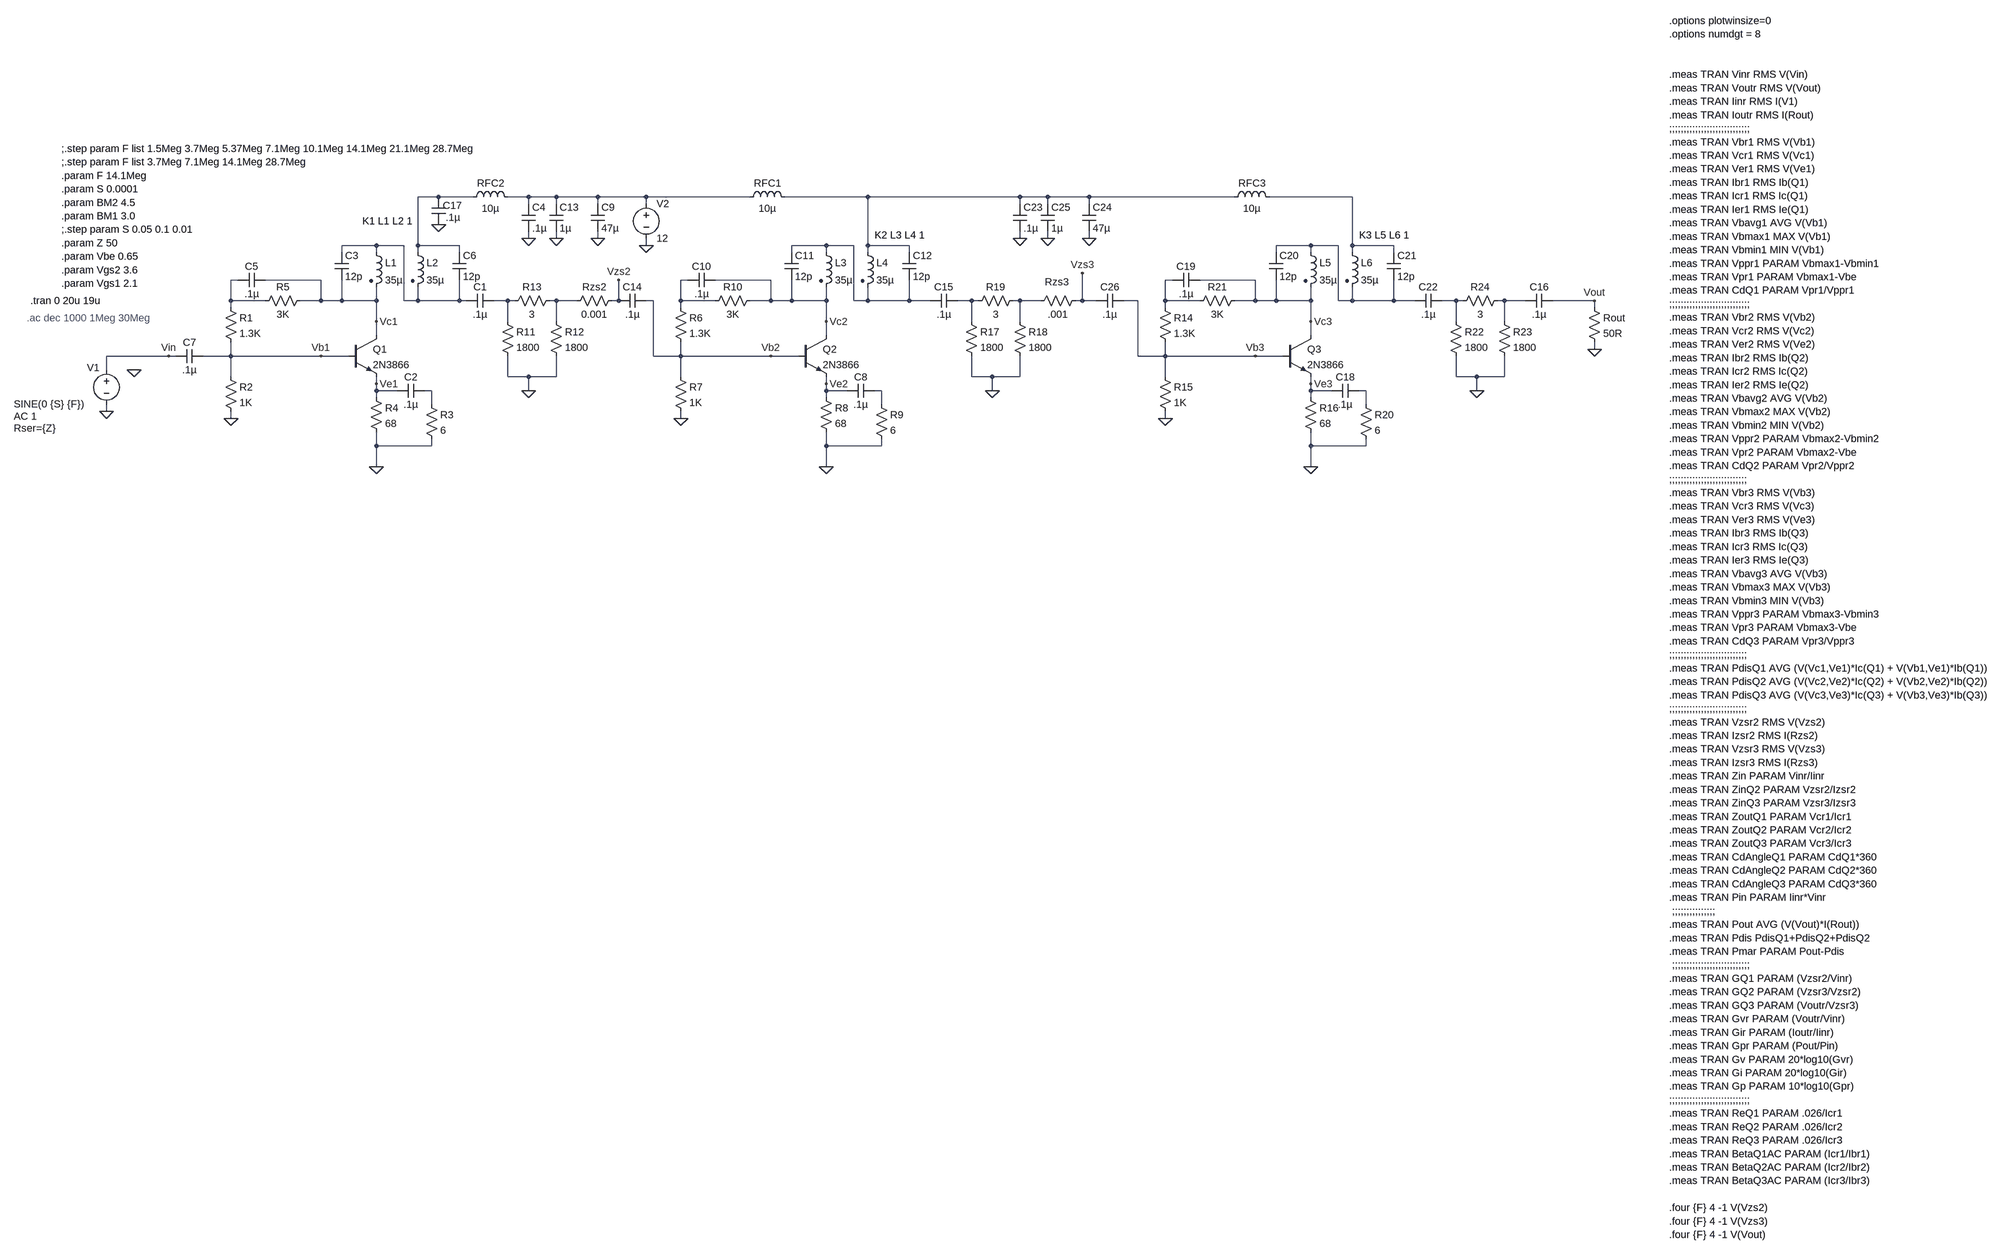
[diagram p0: schematic 2N3866 x3 EMRFD testing.asc]
2N3866 x3 EMRFD testing.asc, the LTspice schematic file:
Version 4
SHEET 1 5068 2428
WIRE 560 -176 512 -176
WIRE 640 -176 560 -176
WIRE 768 -176 720 -176
WIRE 832 -176 768 -176
WIRE 928 -176 832 -176
WIRE 1040 -176 928 -176
WIRE 1280 -176 1040 -176
WIRE 1552 -176 1360 -176
WIRE 1904 -176 1552 -176
WIRE 1968 -176 1904 -176
WIRE 2064 -176 1968 -176
WIRE 2400 -176 2064 -176
WIRE 2672 -176 2480 -176
WIRE 768 -160 768 -176
WIRE 832 -160 832 -176
WIRE 928 -160 928 -176
WIRE 1040 -160 1040 -176
WIRE 1904 -160 1904 -176
WIRE 1968 -160 1968 -176
WIRE 2064 -160 2064 -176
WIRE 768 -80 768 -96
WIRE 832 -80 832 -96
WIRE 928 -80 928 -96
WIRE 1904 -80 1904 -96
WIRE 1968 -80 1968 -96
WIRE 2064 -80 2064 -96
WIRE 416 -64 336 -64
WIRE 480 -64 416 -64
WIRE 512 -64 512 -176
WIRE 608 -64 512 -64
WIRE 1040 -64 1040 -80
WIRE 1456 -64 1376 -64
WIRE 1520 -64 1456 -64
WIRE 1552 -64 1552 -176
WIRE 1648 -64 1552 -64
WIRE 2576 -64 2496 -64
WIRE 2640 -64 2576 -64
WIRE 2672 -64 2672 -176
WIRE 2768 -64 2672 -64
WIRE 336 -48 336 -64
WIRE 416 -48 416 -64
WIRE 512 -48 512 -64
WIRE 608 -48 608 -64
WIRE 1376 -48 1376 -64
WIRE 1456 -48 1456 -64
WIRE 1552 -48 1552 -64
WIRE 1648 -48 1648 -64
WIRE 2496 -48 2496 -64
WIRE 2576 -48 2576 -64
WIRE 2672 -48 2672 -64
WIRE 2768 -48 2768 -64
WIRE 96 16 80 16
WIRE 288 16 160 16
WIRE 1136 16 1120 16
WIRE 1328 16 1200 16
WIRE 2256 16 2240 16
WIRE 2448 16 2320 16
WIRE 80 64 80 16
WIRE 160 64 80 64
WIRE 288 64 288 16
WIRE 288 64 240 64
WIRE 336 64 336 16
WIRE 336 64 288 64
WIRE 416 64 416 32
WIRE 416 64 336 64
WIRE 480 64 480 -64
WIRE 512 64 512 32
WIRE 512 64 480 64
WIRE 608 64 608 16
WIRE 608 64 512 64
WIRE 624 64 608 64
WIRE 720 64 688 64
WIRE 736 64 720 64
WIRE 832 64 816 64
WIRE 880 64 832 64
WIRE 976 64 976 16
WIRE 976 64 960 64
WIRE 1056 64 1040 64
WIRE 1120 64 1120 16
WIRE 1200 64 1120 64
WIRE 1328 64 1328 16
WIRE 1328 64 1280 64
WIRE 1376 64 1376 16
WIRE 1376 64 1328 64
WIRE 1456 64 1456 32
WIRE 1456 64 1376 64
WIRE 1520 64 1520 -64
WIRE 1552 64 1552 32
WIRE 1552 64 1520 64
WIRE 1648 64 1648 16
WIRE 1648 64 1552 64
WIRE 1696 64 1648 64
WIRE 1792 64 1760 64
WIRE 1808 64 1792 64
WIRE 1904 64 1888 64
WIRE 1952 64 1904 64
WIRE 2048 64 2048 0
WIRE 2048 64 2032 64
WIRE 2080 64 2048 64
WIRE 2176 64 2144 64
WIRE 2240 64 2240 16
WIRE 2320 64 2240 64
WIRE 2448 64 2448 16
WIRE 2448 64 2400 64
WIRE 2496 64 2496 16
WIRE 2496 64 2448 64
WIRE 2576 64 2576 32
WIRE 2576 64 2496 64
WIRE 2640 64 2640 -64
WIRE 2672 64 2672 32
WIRE 2672 64 2640 64
WIRE 2768 64 2768 16
WIRE 2768 64 2672 64
WIRE 2816 64 2768 64
WIRE 2912 64 2880 64
WIRE 2928 64 2912 64
WIRE 3024 64 3008 64
WIRE 3072 64 3024 64
WIRE 3232 64 3136 64
WIRE 80 80 80 64
WIRE 1120 80 1120 64
WIRE 2240 80 2240 64
WIRE 3232 80 3232 64
WIRE 416 112 416 64
WIRE 720 112 720 64
WIRE 832 112 832 64
WIRE 1456 112 1456 64
WIRE 1792 112 1792 64
WIRE 1904 112 1904 64
WIRE 2576 112 2576 64
WIRE 2912 112 2912 64
WIRE 3024 112 3024 64
WIRE 416 144 416 112
WIRE 1456 144 1456 112
WIRE 2576 144 2576 112
WIRE 3232 176 3232 160
WIRE -64 192 -208 192
WIRE -48 192 -64 192
WIRE 80 192 80 160
WIRE 80 192 16 192
WIRE 288 192 80 192
WIRE 352 192 288 192
WIRE 1056 192 1056 64
WIRE 1120 192 1120 160
WIRE 1120 192 1056 192
WIRE 1328 192 1120 192
WIRE 1392 192 1328 192
WIRE 2176 192 2176 64
WIRE 2240 192 2240 160
WIRE 2240 192 2176 192
WIRE 2448 192 2240 192
WIRE 2512 192 2448 192
WIRE -208 224 -208 192
WIRE 80 240 80 192
WIRE 720 240 720 192
WIRE 768 240 720 240
WIRE 832 240 832 192
WIRE 832 240 768 240
WIRE 1120 240 1120 192
WIRE 1792 240 1792 192
WIRE 1840 240 1792 240
WIRE 1904 240 1904 192
WIRE 1904 240 1840 240
WIRE 2240 240 2240 192
WIRE 2912 240 2912 192
WIRE 2960 240 2912 240
WIRE 3024 240 3024 192
WIRE 3024 240 2960 240
WIRE 416 256 416 240
WIRE 1456 256 1456 240
WIRE 2576 256 2576 240
WIRE 416 272 416 256
WIRE 464 272 416 272
WIRE 544 272 528 272
WIRE 768 272 768 240
WIRE 1456 272 1456 256
WIRE 1504 272 1456 272
WIRE 1584 272 1568 272
WIRE 1840 272 1840 240
WIRE 2576 272 2576 256
WIRE 2624 272 2576 272
WIRE 2704 272 2688 272
WIRE 2960 272 2960 240
WIRE 416 288 416 272
WIRE 1456 288 1456 272
WIRE 2576 288 2576 272
WIRE 544 304 544 272
WIRE 1584 304 1584 272
WIRE 2704 304 2704 272
WIRE -208 320 -208 304
WIRE 80 336 80 320
WIRE 1120 336 1120 320
WIRE 2240 336 2240 320
WIRE 416 400 416 368
WIRE 544 400 544 384
WIRE 544 400 416 400
WIRE 1456 400 1456 368
WIRE 1584 400 1584 384
WIRE 1584 400 1456 400
WIRE 2576 400 2576 368
WIRE 2704 400 2704 384
WIRE 2704 400 2576 400
WIRE 416 448 416 400
WIRE 1456 448 1456 400
WIRE 2576 448 2576 400
FLAG -208 320 0
FLAG 80 336 0
FLAG 416 448 0
FLAG 3232 64 Vout
FLAG 3232 176 0
FLAG 288 192 Vb1
FLAG 416 256 Ve1
FLAG -64 192 Vin
FLAG 416 112 Vc1
FLAG -144 224 0
FLAG 768 -80 0
FLAG 1120 336 0
FLAG 1456 448 0
FLAG 1328 192 Vb2
FLAG 1456 256 Ve2
FLAG 1456 112 Vc2
FLAG 1040 -64 0
FLAG 928 -80 0
FLAG 832 -80 0
FLAG 768 272 0
FLAG 560 -112 0
FLAG 976 16 Vzs2
FLAG 2048 0 Vzs3
FLAG 1840 272 0
FLAG 2240 336 0
FLAG 2576 448 0
FLAG 2448 192 Vb3
FLAG 2576 256 Ve3
FLAG 2576 112 Vc3
FLAG 2960 272 0
FLAG 1904 -80 0
FLAG 2064 -80 0
FLAG 1968 -80 0
SYMBOL voltage -208 208 R0
WINDOW 0 -45 11 Left 2
WINDOW 3 -214 95 Left 2
WINDOW 123 -214 123 Left 2
WINDOW 39 -214 151 Left 2
SYMATTR InstName V1
SYMATTR Value SINE(0 {S} {F})
SYMATTR Value2 AC 1
SYMATTR SpiceLine Rser={Z}
SYMBOL res 64 64 R0
SYMATTR InstName R1
SYMATTR Value 1.3K
SYMBOL res 64 224 R0
SYMATTR InstName R2
SYMATTR Value 1K
SYMBOL res 400 272 R0
SYMATTR InstName R4
SYMATTR Value 68
SYMBOL ind2 400 -64 R0
SYMATTR InstName L1
SYMATTR Value 35µ
SYMATTR Type ind
SYMBOL res 3216 64 R0
SYMATTR InstName Rout
SYMATTR Value 50R
SYMBOL cap 16 176 R90
WINDOW 0 0 32 VBottom 2
WINDOW 3 32 32 VTop 2
SYMATTR InstName C7
SYMATTR Value .1µ
SYMBOL ind2 496 -64 R0
SYMATTR InstName L2
SYMATTR Value 35µ
SYMATTR Type ind
SYMBOL npn 352 144 R0
SYMATTR InstName Q1
SYMATTR Value 2N3866
SYMBOL cap 688 48 R90
WINDOW 0 0 32 VBottom 2
WINDOW 3 32 32 VTop 2
SYMATTR InstName C1
SYMATTR Value .1µ
SYMBOL cap 528 256 R90
WINDOW 0 0 32 VBottom 2
WINDOW 3 32 32 VTop 2
SYMATTR InstName C2
SYMATTR Value .1µ
SYMBOL res 528 288 R0
SYMATTR InstName R3
SYMATTR Value 6
SYMBOL res 256 48 R90
WINDOW 0 0 56 VBottom 2
WINDOW 3 32 56 VTop 2
SYMATTR InstName R5
SYMATTR Value 3K
SYMBOL cap 160 0 R90
WINDOW 0 0 32 VBottom 2
WINDOW 3 32 32 VTop 2
SYMATTR InstName C5
SYMATTR Value .1µ
SYMBOL cap 320 -48 R0
SYMATTR InstName C3
SYMATTR Value 12p
SYMBOL cap 592 -48 R0
SYMATTR InstName C6
SYMATTR Value 12p
SYMBOL cap 752 -160 R0
SYMATTR InstName C4
SYMATTR Value .1µ
SYMBOL res 1104 64 R0
SYMATTR InstName R6
SYMATTR Value 1.3K
SYMBOL res 1104 224 R0
SYMATTR InstName R7
SYMATTR Value 1K
SYMBOL res 1440 272 R0
SYMATTR InstName R8
SYMATTR Value 68
SYMBOL ind2 1440 -64 R0
SYMATTR InstName L3
SYMATTR Value 35µ
SYMATTR Type ind
SYMBOL ind2 1536 -64 R0
SYMATTR InstName L4
SYMATTR Value 35µ
SYMATTR Type ind
SYMBOL npn 1392 144 R0
SYMATTR InstName Q2
SYMATTR Value 2N3866
SYMBOL voltage 1040 -176 R0
WINDOW 123 0 0 Left 0
WINDOW 39 0 0 Left 0
SYMATTR InstName V2
SYMATTR Value 12
SYMBOL cap 1568 256 R90
WINDOW 0 0 32 VBottom 2
WINDOW 3 32 32 VTop 2
SYMATTR InstName C8
SYMATTR Value .1µ
SYMBOL res 1568 288 R0
SYMATTR InstName R9
SYMATTR Value 6
SYMBOL cap 912 -160 R0
SYMATTR InstName C9
SYMATTR Value 47µ
SYMBOL res 1296 48 R90
WINDOW 0 0 56 VBottom 2
WINDOW 3 32 56 VTop 2
SYMATTR InstName R10
SYMATTR Value 3K
SYMBOL cap 1200 0 R90
WINDOW 0 0 32 VBottom 2
WINDOW 3 32 32 VTop 2
SYMATTR InstName C10
SYMATTR Value .1µ
SYMBOL cap 1360 -48 R0
SYMATTR InstName C11
SYMATTR Value 12p
SYMBOL cap 1632 -48 R0
SYMATTR InstName C12
SYMATTR Value 12p
SYMBOL cap 816 -160 R0
SYMATTR InstName C13
SYMATTR Value 1µ
SYMBOL res 704 96 R0
SYMATTR InstName R11
SYMATTR Value 1800
SYMBOL res 816 96 R0
SYMATTR InstName R12
SYMATTR Value 1800
SYMBOL res 832 48 R90
WINDOW 0 0 56 VBottom 2
WINDOW 3 32 56 VTop 2
SYMATTR InstName R13
SYMATTR Value 3
SYMBOL cap 1040 48 R90
WINDOW 0 0 32 VBottom 2
WINDOW 3 32 32 VTop 2
SYMATTR InstName C14
SYMATTR Value .1µ
SYMBOL cap 1760 48 R90
WINDOW 0 0 32 VBottom 2
WINDOW 3 32 32 VTop 2
SYMATTR InstName C15
SYMATTR Value .1µ
SYMBOL ind 1264 -160 R270
WINDOW 0 32 56 VTop 2
WINDOW 3 5 56 VBottom 2
SYMATTR InstName RFC1
SYMATTR Value 10µ
SYMBOL ind 624 -160 R270
WINDOW 0 32 56 VTop 2
WINDOW 3 5 56 VBottom 2
SYMATTR InstName RFC2
SYMATTR Value 10µ
SYMBOL cap 544 -176 R0
WINDOW 0 26 20 Left 2
WINDOW 3 32 47 Left 2
SYMATTR InstName C17
SYMATTR Value .1µ
SYMBOL res 976 48 R90
WINDOW 0 0 56 VBottom 2
WINDOW 3 32 56 VTop 2
SYMATTR InstName Rzs2
SYMATTR Value 0.001
SYMBOL res 2048 48 R90
WINDOW 0 -12 59 VBottom 2
WINDOW 3 32 56 VTop 2
SYMATTR InstName Rzs3
SYMATTR Value .001
SYMBOL cap 3136 48 R90
WINDOW 0 0 32 VBottom 2
WINDOW 3 32 32 VTop 2
SYMATTR InstName C16
SYMATTR Value .1µ
SYMBOL res 1776 96 R0
SYMATTR InstName R17
SYMATTR Value 1800
SYMBOL res 1888 96 R0
SYMATTR InstName R18
SYMATTR Value 1800
SYMBOL res 1904 48 R90
WINDOW 0 0 56 VBottom 2
WINDOW 3 32 56 VTop 2
SYMATTR InstName R19
SYMATTR Value 3
SYMBOL res 2224 64 R0
SYMATTR InstName R14
SYMATTR Value 1.3K
SYMBOL res 2224 224 R0
SYMATTR InstName R15
SYMATTR Value 1K
SYMBOL res 2560 272 R0
SYMATTR InstName R16
SYMATTR Value 68
SYMBOL ind2 2560 -64 R0
SYMATTR InstName L5
SYMATTR Value 35µ
SYMATTR Type ind
SYMBOL ind2 2656 -64 R0
SYMATTR InstName L6
SYMATTR Value 35µ
SYMATTR Type ind
SYMBOL npn 2512 144 R0
SYMATTR InstName Q3
SYMATTR Value 2N3866
SYMBOL cap 2688 256 R90
WINDOW 0 0 32 VBottom 2
WINDOW 3 32 32 VTop 2
SYMATTR InstName C18
SYMATTR Value .1µ
SYMBOL res 2688 288 R0
SYMATTR InstName R20
SYMATTR Value 6
SYMBOL res 2416 48 R90
WINDOW 0 0 56 VBottom 2
WINDOW 3 32 56 VTop 2
SYMATTR InstName R21
SYMATTR Value 3K
SYMBOL cap 2320 0 R90
WINDOW 0 0 32 VBottom 2
WINDOW 3 32 32 VTop 2
SYMATTR InstName C19
SYMATTR Value .1µ
SYMBOL cap 2480 -48 R0
SYMATTR InstName C20
SYMATTR Value 12p
SYMBOL cap 2752 -48 R0
SYMATTR InstName C21
SYMATTR Value 12p
SYMBOL cap 2880 48 R90
WINDOW 0 0 32 VBottom 2
WINDOW 3 32 32 VTop 2
SYMATTR InstName C22
SYMATTR Value .1µ
SYMBOL ind 2384 -160 R270
WINDOW 0 32 56 VTop 2
WINDOW 3 5 56 VBottom 2
SYMATTR InstName RFC3
SYMATTR Value 10µ
SYMBOL res 2896 96 R0
SYMATTR InstName R22
SYMATTR Value 1800
SYMBOL res 3008 96 R0
SYMATTR InstName R23
SYMATTR Value 1800
SYMBOL res 3024 48 R90
WINDOW 0 0 56 VBottom 2
WINDOW 3 32 56 VTop 2
SYMATTR InstName R24
SYMATTR Value 3
SYMBOL cap 1888 -160 R0
SYMATTR InstName C23
SYMATTR Value .1µ
SYMBOL cap 2048 -160 R0
SYMATTR InstName C24
SYMATTR Value 47µ
SYMBOL cap 1952 -160 R0
SYMATTR InstName C25
SYMATTR Value 1µ
SYMBOL cap 2144 48 R90
WINDOW 0 0 32 VBottom 2
WINDOW 3 32 32 VTop 2
SYMATTR InstName C26
SYMATTR Value .1µ
TEXT -384 64 Left 2 !.tran 0 20u 19u
TEXT 3736 -584 Left 2 !.options plotwinsize=0\n.options numdgt = 8\n \n \n.meas TRAN Vinr RMS V(Vin)\n.meas TRAN Voutr RMS V(Vout)\n.meas TRAN Iinr RMS I(V1)\n.meas TRAN Ioutr RMS I(Rout)\n;;;;;;;;;;;;;;;;;;;;;;;;;;;;\n.meas TRAN Vbr1 RMS V(Vb1)\n.meas TRAN Vcr1 RMS V(Vc1)\n.meas TRAN Ver1 RMS V(Ve1)\n.meas TRAN Ibr1 RMS Ib(Q1)\n.meas TRAN Icr1 RMS Ic(Q1)\n.meas TRAN Ier1 RMS Ie(Q1)\n.meas TRAN Vbavg1 AVG V(Vb1)\n.meas TRAN Vbmax1 MAX V(Vb1)\n.meas TRAN Vbmin1 MIN V(Vb1)\n.meas TRAN Vppr1 PARAM Vbmax1-Vbmin1\n.meas TRAN Vpr1 PARAM Vbmax1-Vbe\n.meas TRAN CdQ1 PARAM Vpr1/Vppr1\n;;;;;;;;;;;;;;;;;;;;;;;;;;;;\n.meas TRAN Vbr2 RMS V(Vb2)\n.meas TRAN Vcr2 RMS V(Vc2)\n.meas TRAN Ver2 RMS V(Ve2)\n.meas TRAN Ibr2 RMS Ib(Q2)\n.meas TRAN Icr2 RMS Ic(Q2)\n.meas TRAN Ier2 RMS Ie(Q2)\n.meas TRAN Vbavg2 AVG V(Vb2)\n.meas TRAN Vbmax2 MAX V(Vb2)\n.meas TRAN Vbmin2 MIN V(Vb2)\n.meas TRAN Vppr2 PARAM Vbmax2-Vbmin2\n.meas TRAN Vpr2 PARAM Vbmax2-Vbe\n.meas TRAN CdQ2 PARAM Vpr2/Vppr2\n;;;;;;;;;;;;;;;;;;;;;;;;;;;\n.meas TRAN Vbr3 RMS V(Vb3)\n.meas TRAN Vcr3 RMS V(Vc3)\n.meas TRAN Ver3 RMS V(Ve3)\n.meas TRAN Ibr3 RMS Ib(Q3)\n.meas TRAN Icr3 RMS Ic(Q3)\n.meas TRAN Ier3 RMS Ie(Q3)\n.meas TRAN Vbavg3 AVG V(Vb3)\n.meas TRAN Vbmax3 MAX V(Vb3)\n.meas TRAN Vbmin3 MIN V(Vb3)\n.meas TRAN Vppr3 PARAM Vbmax3-Vbmin3\n.meas TRAN Vpr3 PARAM Vbmax3-Vbe\n.meas TRAN CdQ3 PARAM Vpr3/Vppr3\n;;;;;;;;;;;;;;;;;;;;;;;;;;;\n.meas TRAN PdisQ1 AVG (V(Vc1,Ve1)*Ic(Q1) + V(Vb1,Ve1)*Ib(Q1))\n.meas TRAN PdisQ2 AVG (V(Vc2,Ve2)*Ic(Q2) + V(Vb2,Ve2)*Ib(Q2))\n.meas TRAN PdisQ3 AVG (V(Vc3,Ve3)*Ic(Q3) + V(Vb3,Ve3)*Ib(Q3))\n;;;;;;;;;;;;;;;;;;;;;;;;;;;\n.meas TRAN Vzsr2 RMS V(Vzs2)\n.meas TRAN Izsr2 RMS I(Rzs2)\n.meas TRAN Vzsr3 RMS V(Vzs3)\n.meas TRAN Izsr3 RMS I(Rzs3)\n.meas TRAN Zin PARAM Vinr/Iinr\n.meas TRAN ZinQ2 PARAM Vzsr2/Izsr2\n.meas TRAN ZinQ3 PARAM Vzsr3/Izsr3\n.meas TRAN ZoutQ1 PARAM Vcr1/Icr1\n.meas TRAN ZoutQ2 PARAM Vcr2/Icr2\n.meas TRAN ZoutQ3 PARAM Vcr3/Icr3\n.meas TRAN CdAngleQ1 PARAM CdQ1*360\n.meas TRAN CdAngleQ2 PARAM CdQ2*360\n.meas TRAN CdAngleQ3 PARAM CdQ3*360\n.meas TRAN Pin PARAM Iinr*Vinr\n ;;;;;;;;;;;;;;;\n.meas TRAN Pout AVG (V(Vout)*I(Rout))\n.meas TRAN Pdis PdisQ1+PdisQ2+PdisQ2\n.meas TRAN Pmar PARAM Pout-Pdis\n ;;;;;;;;;;;;;;;;;;;;;;;;;;;\n.meas TRAN GQ1 PARAM (Vzsr2/Vinr)\n.meas TRAN GQ2 PARAM (Vzsr3/Vzsr2)\n.meas TRAN GQ3 PARAM (Voutr/Vzsr3)\n.meas TRAN Gvr PARAM (Voutr/Vinr)\n.meas TRAN Gir PARAM (Ioutr/Iinr)\n.meas TRAN Gpr PARAM (Pout/Pin)\n.meas TRAN Gv PARAM 20*log10(Gvr)\n.meas TRAN Gi PARAM 20*log10(Gir)\n.meas TRAN Gp PARAM 10*log10(Gpr)\n;;;;;;;;;;;;;;;;;;;;;;;;;;;;\n.meas TRAN ReQ1 PARAM .026/Icr1\n.meas TRAN ReQ2 PARAM .026/Icr2\n.meas TRAN ReQ3 PARAM .026/Icr3\n.meas TRAN BetaQ1AC PARAM (Icr1/Ibr1)\n.meas TRAN BetaQ2AC PARAM (Icr2/Ibr2)\n.meas TRAN BetaQ3AC PARAM (Icr3/Ibr3)\n \n.four {F} 4 -1 V(Vzs2)\n.four {F} 4 -1 V(Vzs3)\n.four {F} 4 -1 V(Vout)
TEXT -312 -288 Left 2 !;.step param F list 1.5Meg 3.7Meg 5.37Meg 7.1Meg 10.1Meg 14.1Meg 21.1Meg 28.7Meg\n;.step param F list 3.7Meg 7.1Meg 14.1Meg 28.7Meg\n.param F 14.1Meg\n.param S 0.0001\n.param BM2 4.5\n.param BM1 3.0\n;.step param S 0.05 0.1 0.01\n.param Z 50\n.param Vbe 0.65\n.param Vgs2 3.6\n.param Vgs1 2.1
TEXT -392 104 Left 2 ;.ac dec 1000 1Meg 30Meg
TEXT 384 -120 Left 2 !K1 L1 L2 1
TEXT 1568 -88 Left 2 !K2 L3 L4 1
TEXT 2688 -88 Left 2 !K3 L5 L6 1

The netlist it stands for:
* 2N3866 x3 EMRFD testing.asc
V1 Vin 0 SINE(0 {S} {F}) AC 1 Rser={Z}
R1 N008 Vb1 1.3K
R2 Vb1 0 1K
R4 Ve1 0 68
L1 N005 Vc1 35µ
Rout Vout 0 50R
C7 Vb1 Vin .1µ
L2 N001 N005 35µ
Q1 Vc1 Vb1 Ve1 0 2N3866
C1 N011 N005 .1µ
C2 N017 Ve1 .1µ
R3 N017 0 6
R5 Vc1 N008 3K
C5 Vc1 N008 .1µ
C3 N005 Vc1 12p
C6 N001 N005 12p
C4 N002 0 .1µ
R6 N009 Vb2 1.3K
R7 Vb2 0 1K
R8 Ve2 0 68
L3 N006 Vc2 35µ
L4 N003 N006 35µ
Q2 Vc2 Vb2 Ve2 0 2N3866
V2 N002 0 12
C8 N018 Ve2 .1µ
R9 N018 0 6
C9 N002 0 47µ
R10 Vc2 N009 3K
C10 Vc2 N009 .1µ
C11 N006 Vc2 12p
C12 N003 N006 12p
C13 N002 0 1µ
R11 N011 0 1800
R12 N012 0 1800
R13 N012 N011 3
C14 Vb2 Vzs2 .1µ
C15 N013 N006 .1µ
L§RFC1 N002 N003 10µ
L§RFC2 N001 N002 10µ
C17 N001 0 .1µ
Rzs2 Vzs2 N012 0.001
Rzs3 Vzs3 N014 .001
C16 Vout N016 .1µ
R17 N013 0 1800
R18 N014 0 1800
R19 N014 N013 3
R14 N010 Vb3 1.3K
R15 Vb3 0 1K
R16 Ve3 0 68
L5 N007 Vc3 35µ
L6 N004 N007 35µ
Q3 Vc3 Vb3 Ve3 0 2N3866
C18 N019 Ve3 .1µ
R20 N019 0 6
R21 Vc3 N010 3K
C19 Vc3 N010 .1µ
C20 N007 Vc3 12p
C21 N004 N007 12p
C22 N015 N007 .1µ
L§RFC3 N003 N004 10µ
R22 N015 0 1800
R23 N016 0 1800
R24 N016 N015 3
C23 N003 0 .1µ
C24 N003 0 47µ
C25 N003 0 1µ
C26 Vb3 Vzs3 .1µ
.model NPN NPN
.model PNP PNP
.lib standard.bjt
.tran 0 20u 19u
.options plotwinsize=0
.options numdgt = 8
.meas TRAN Vinr RMS V(Vin)
.meas TRAN Voutr RMS V(Vout)
.meas TRAN Iinr RMS I(V1)
.meas TRAN Ioutr RMS I(Rout)
;;;;;;;;;;;;;;;;;;;;;;;;;;;;
.meas TRAN Vbr1 RMS V(Vb1)
.meas TRAN Vcr1 RMS V(Vc1)
.meas TRAN Ver1 RMS V(Ve1)
.meas TRAN Ibr1 RMS Ib(Q1)
.meas TRAN Icr1 RMS Ic(Q1)
.meas TRAN Ier1 RMS Ie(Q1)
.meas TRAN Vbavg1 AVG V(Vb1)
.meas TRAN Vbmax1 MAX V(Vb1)
.meas TRAN Vbmin1 MIN V(Vb1)
.meas TRAN Vppr1 PARAM Vbmax1-Vbmin1
.meas TRAN Vpr1 PARAM Vbmax1-Vbe
.meas TRAN CdQ1 PARAM Vpr1/Vppr1
;;;;;;;;;;;;;;;;;;;;;;;;;;;;
.meas TRAN Vbr2 RMS V(Vb2)
.meas TRAN Vcr2 RMS V(Vc2)
.meas TRAN Ver2 RMS V(Ve2)
.meas TRAN Ibr2 RMS Ib(Q2)
.meas TRAN Icr2 RMS Ic(Q2)
.meas TRAN Ier2 RMS Ie(Q2)
.meas TRAN Vbavg2 AVG V(Vb2)
.meas TRAN Vbmax2 MAX V(Vb2)
.meas TRAN Vbmin2 MIN V(Vb2)
.meas TRAN Vppr2 PARAM Vbmax2-Vbmin2
.meas TRAN Vpr2 PARAM Vbmax2-Vbe
.meas TRAN CdQ2 PARAM Vpr2/Vppr2
;;;;;;;;;;;;;;;;;;;;;;;;;;;
.meas TRAN Vbr3 RMS V(Vb3)
.meas TRAN Vcr3 RMS V(Vc3)
.meas TRAN Ver3 RMS V(Ve3)
.meas TRAN Ibr3 RMS Ib(Q3)
.meas TRAN Icr3 RMS Ic(Q3)
.meas TRAN Ier3 RMS Ie(Q3)
.meas TRAN Vbavg3 AVG V(Vb3)
.meas TRAN Vbmax3 MAX V(Vb3)
.meas TRAN Vbmin3 MIN V(Vb3)
.meas TRAN Vppr3 PARAM Vbmax3-Vbmin3
.meas TRAN Vpr3 PARAM Vbmax3-Vbe
.meas TRAN CdQ3 PARAM Vpr3/Vppr3
;;;;;;;;;;;;;;;;;;;;;;;;;;;
.meas TRAN PdisQ1 AVG (V(Vc1,Ve1)*Ic(Q1) + V(Vb1,Ve1)*Ib(Q1))
.meas TRAN PdisQ2 AVG (V(Vc2,Ve2)*Ic(Q2) + V(Vb2,Ve2)*Ib(Q2))
.meas TRAN PdisQ3 AVG (V(Vc3,Ve3)*Ic(Q3) + V(Vb3,Ve3)*Ib(Q3))
;;;;;;;;;;;;;;;;;;;;;;;;;;;
.meas TRAN Vzsr2 RMS V(Vzs2)
.meas TRAN Izsr2 RMS I(Rzs2)
.meas TRAN Vzsr3 RMS V(Vzs3)
.meas TRAN Izsr3 RMS I(Rzs3)
.meas TRAN Zin PARAM Vinr/Iinr
.meas TRAN ZinQ2 PARAM Vzsr2/Izsr2
.meas TRAN ZinQ3 PARAM Vzsr3/Izsr3
.meas TRAN ZoutQ1 PARAM Vcr1/Icr1
.meas TRAN ZoutQ2 PARAM Vcr2/Icr2
.meas TRAN ZoutQ3 PARAM Vcr3/Icr3
.meas TRAN CdAngleQ1 PARAM CdQ1*360
.meas TRAN CdAngleQ2 PARAM CdQ2*360
.meas TRAN CdAngleQ3 PARAM CdQ3*360
.meas TRAN Pin PARAM Iinr*Vinr
 ;;;;;;;;;;;;;;;
.meas TRAN Pout AVG (V(Vout)*I(Rout))
.meas TRAN Pdis PdisQ1+PdisQ2+PdisQ2
.meas TRAN Pmar PARAM Pout-Pdis
 ;;;;;;;;;;;;;;;;;;;;;;;;;;;
.meas TRAN GQ1 PARAM (Vzsr2/Vinr)
.meas TRAN GQ2 PARAM (Vzsr3/Vzsr2)
.meas TRAN GQ3 PARAM (Voutr/Vzsr3)
.meas TRAN Gvr PARAM (Voutr/Vinr)
.meas TRAN Gir PARAM (Ioutr/Iinr)
.meas TRAN Gpr PARAM (Pout/Pin)
.meas TRAN Gv PARAM 20*log10(Gvr)
.meas TRAN Gi PARAM 20*log10(Gir)
.meas TRAN Gp PARAM 10*log10(Gpr)
;;;;;;;;;;;;;;;;;;;;;;;;;;;;
.meas TRAN ReQ1 PARAM .026/Icr1
.meas TRAN ReQ2 PARAM .026/Icr2
.meas TRAN ReQ3 PARAM .026/Icr3
.meas TRAN BetaQ1AC PARAM (Icr1/Ibr1)
.meas TRAN BetaQ2AC PARAM (Icr2/Ibr2)
.meas TRAN BetaQ3AC PARAM (Icr3/Ibr3)
.four {F} 4 -1 V(Vzs2)
.four {F} 4 -1 V(Vzs3)
.four {F} 4 -1 V(Vout)
;.step param F list 1.5Meg 3.7Meg 5.37Meg 7.1Meg 10.1Meg 14.1Meg 21.1Meg 28.7Meg
;.step param F list 3.7Meg 7.1Meg 14.1Meg 28.7Meg
.param F 14.1Meg
.param S 0.0001
.param BM2 4.5
.param BM1 3.0
;.step param S 0.05 0.1 0.01
.param Z 50
.param Vbe 0.65
.param Vgs2 3.6
.param Vgs1 2.1
* .ac dec 1000 1Meg 30Meg
K1 L1 L2 1
K2 L3 L4 1
K3 L5 L6 1
.backanno
.end